# EAGLE design 231_adc (EAGLE 9.6.2)
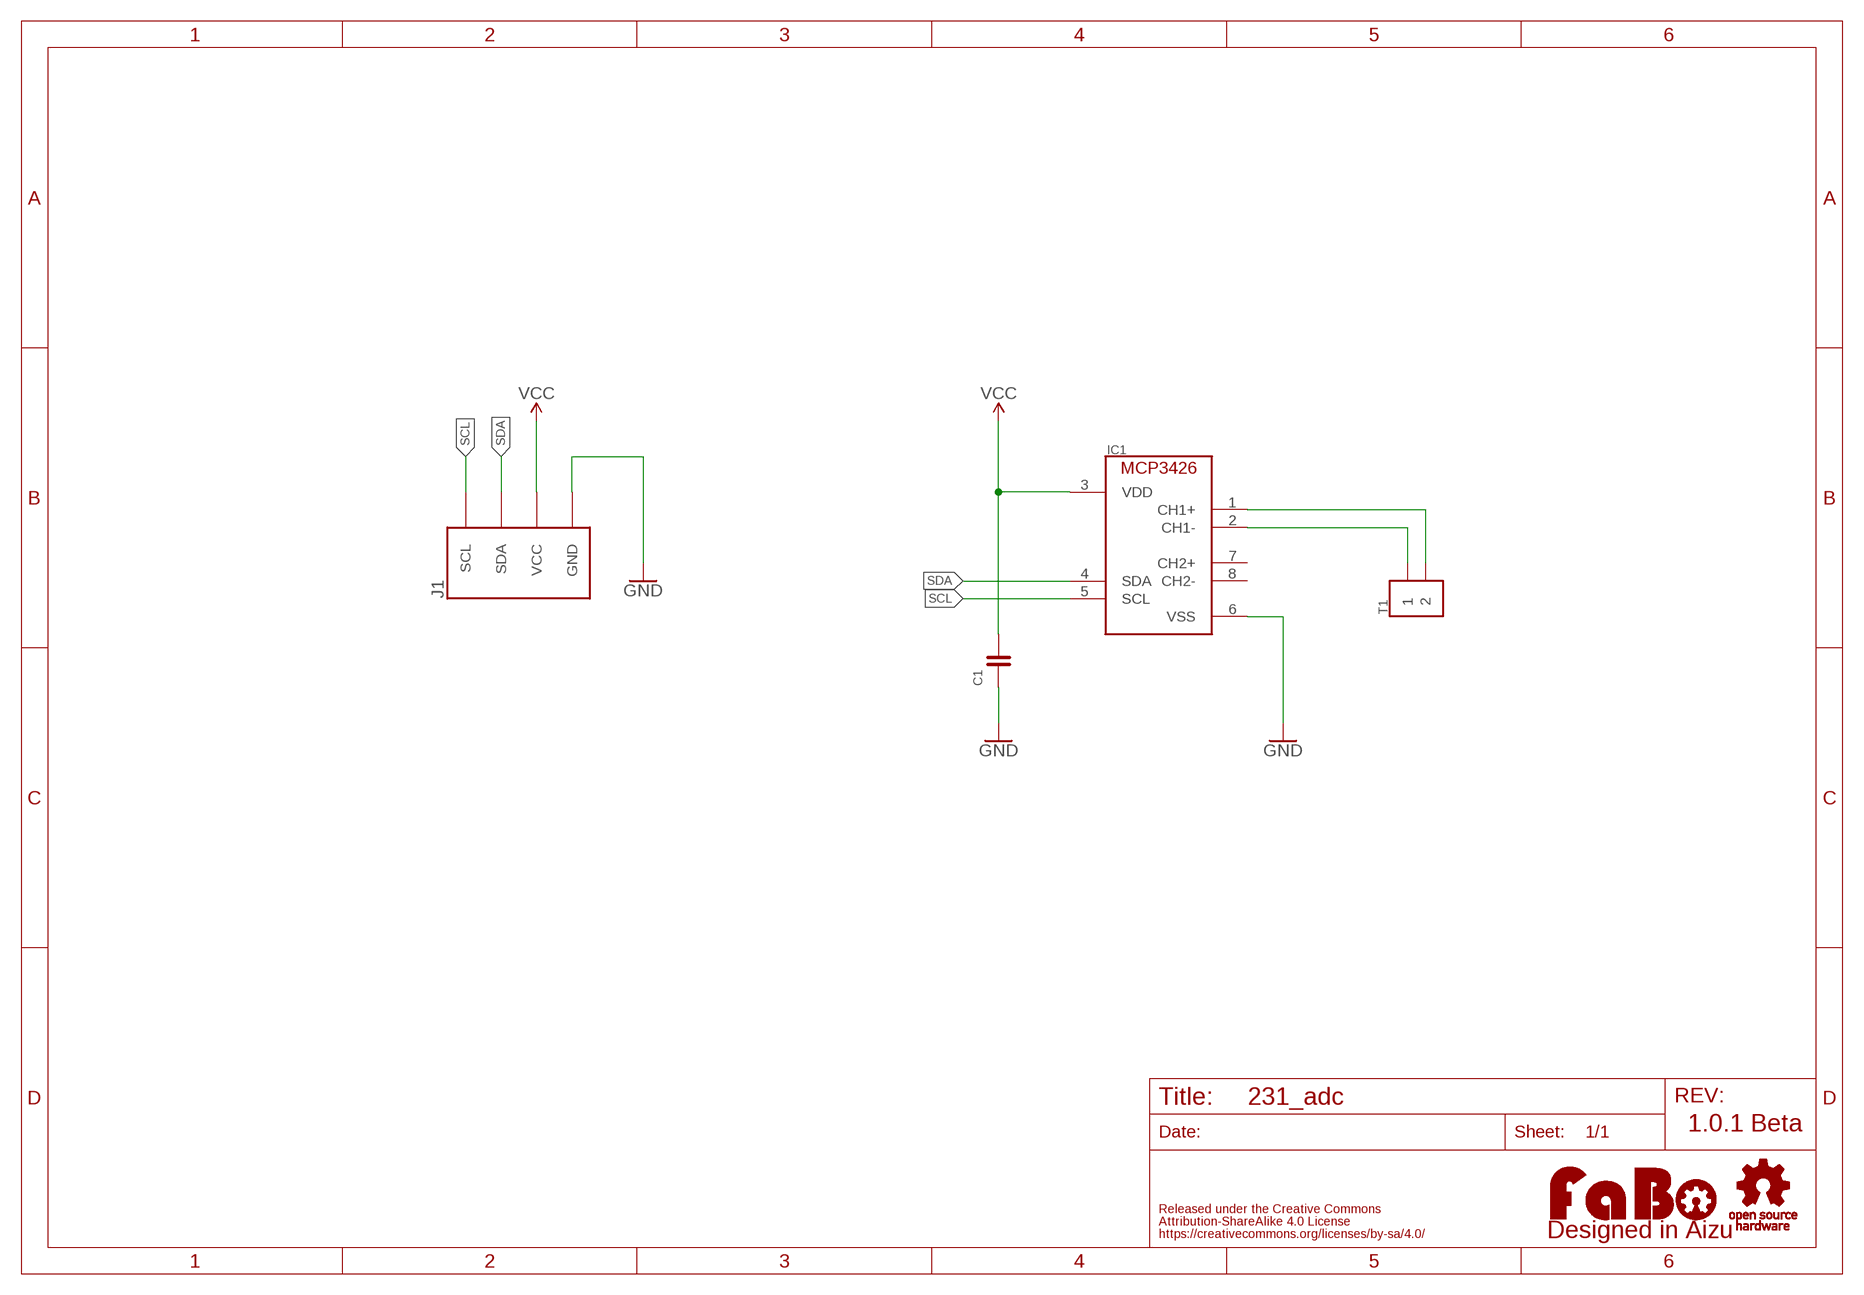
[diagram p0: schematic, sheet 1]

## Parts
C1  CAPACITOR-0603  [EIA0603]
IC1  MCP3426/MS  [MSOP-8]
J1  FABO_BRICK_I2C  [FABO_BRICK_I2C]
LOGO1  LOGO_FABO-M  [LOGO_FABO_M]
T1  ML-1400-S1-2P  [ML-1400-S1-2P]
U$2  LOGO_OSHW-M_BOTTOM  [LOGO_OSHW_M_BOTTOM]

## Nets
CH1M: IC1.2(CH1-) T1.P1-1 T1.P1-2
CH1P: IC1.1(CH1+) T1.P2-1 T1.P2-2
GND: C1.1 IC1.6(VSS) J1.GND
SCL: IC1.5(SCL) J1.SCL
SDA: IC1.4(SDA) J1.SDA
VCC: C1.2 IC1.3(VDD) J1.VCC
Unconnected: IC1.7(CH2+) IC1.8(CH2-)

## Notes on the sheet
- 1.0.1 Beta

## Library data of the parts
C1 = component:CAPACITOR
IC1 = component:MCP3426
J1 = FaBo-Template:FABO_BRICK_I2C: FaBo Brick I2C
LOGO1 = component:LOGO_FABO
T1 = component:ML-1400-S1-2P
U$2 = FaBo-etc:LOGO_OSHW

## Board
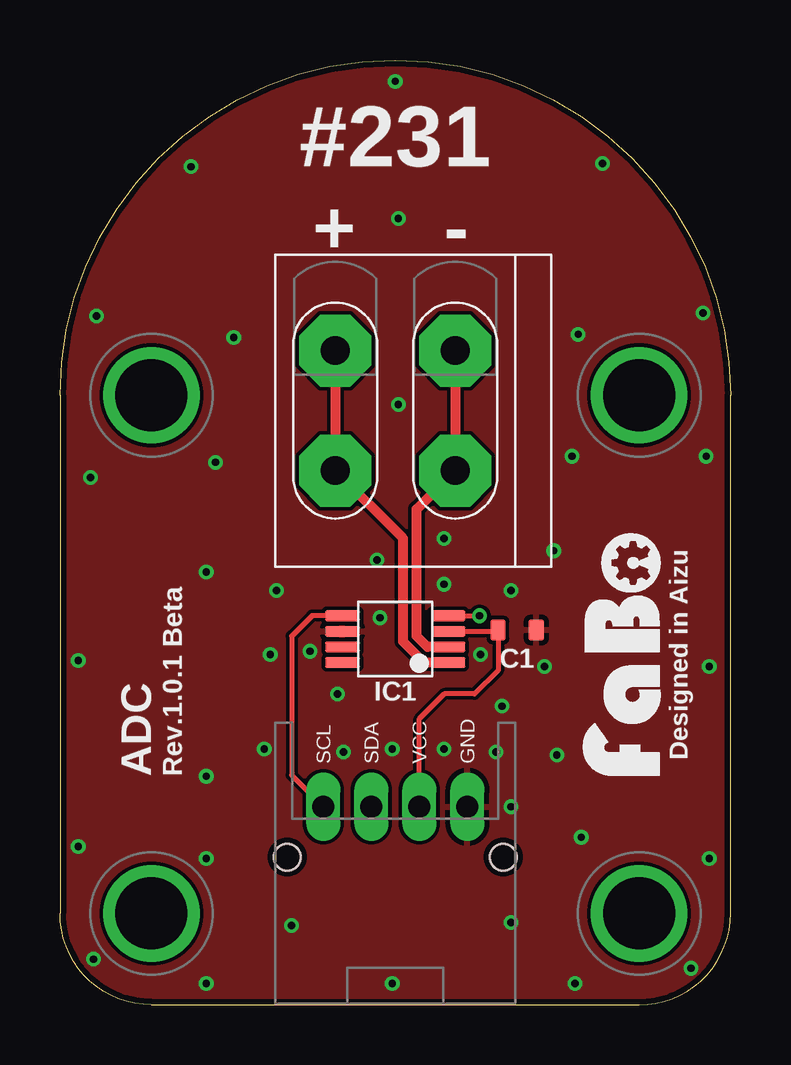
[diagram p1: board, top side]
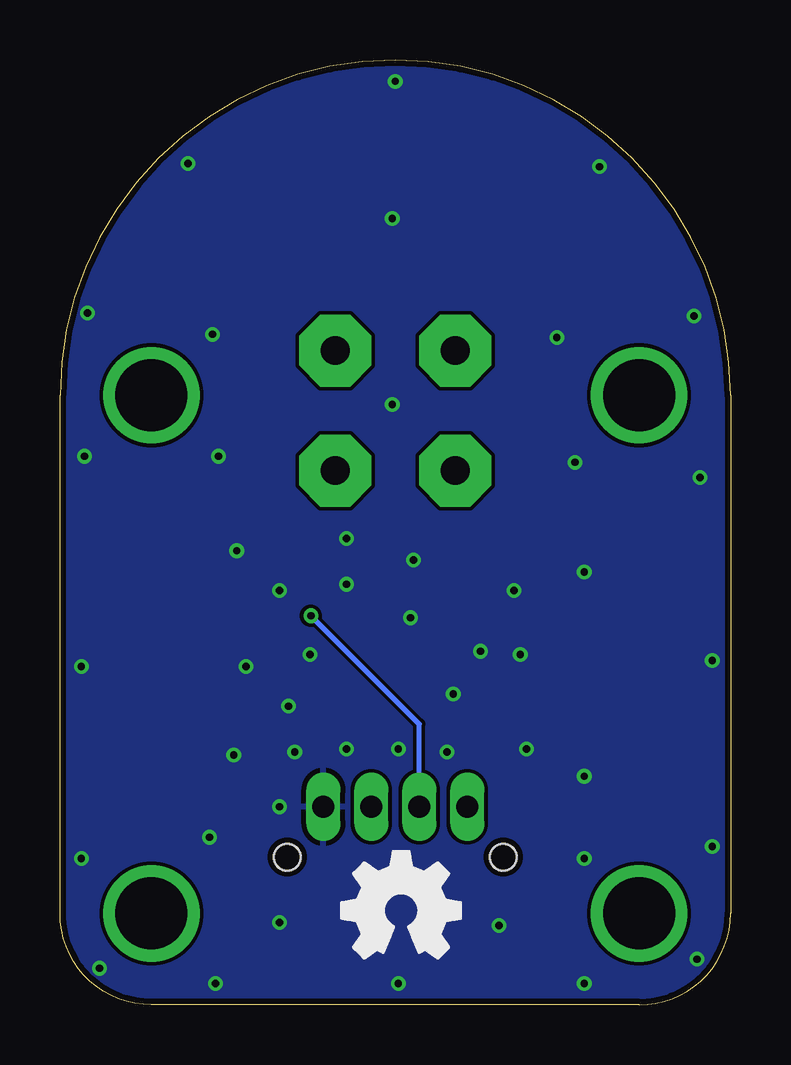
[diagram p2: board, bottom side, seen from below]

Size 27.94 x 39.37 mm. Coordinates in mm from the lower left corner, seen from the top.
Copper layers (1*16): Top 0.035mm / dielectric 1.6mm / Bottom 0.035mm
Design rules "PCBway": minimum track width 6mil, minimum drill 12mil, track to track 6mil, track to pad 6mil, pad to pad 6mil, via to via 6mil, smd to smd 6mil, copper to edge 10mil, drill to drill 10mil, minimum pad ring 10mil, minimum via ring 6mil, stop-mask expansion 2mil, vias tented up to drill 100mil, thermal gap 8mil

### Footprints (pad centres in the part's own frame; a part is rotated, then mirrored left to right if it is on the bottom)
EIA0603 = smd 0.65 x 0.9: 1 -0.8,0; 2 0.8,0
MSOP-8 = smd 0.45 x 1.45: 1 -0.975,-2.2; 2 -0.325,-2.2; 3 0.325,-2.2; 4 0.975,-2.2; 5 0.975,2.2; 6 0.325,2.2; 7 -0.325,2.2; 8 -0.975,2.2
FABO_BRICK_I2C = drill 0.9 pad 1.422 long: GND 3,-10.795; SCL -3,-10.795; SDA -1,-10.795; VCC 1,-10.795 | drill 3 pad 3.81: P$1 -10.16,6.35; P$2 10.16,6.35; P$3 -10.16,-15.24; P$4 10.16,-15.24 | hole 1.1: -4.5,-12.895; 4.5,-12.895
ML-1400-S1-2P = drill 1.2 pad 3 octagon: P1-1 -2.5,2.5; P1-2 -2.5,-2.5; P2-1 2.5,2.5; P2-2 2.5,-2.5

### Placement (x,y rotation side)
C1  19.05,15.62 180 top
IC1  13.97,15.24 90 top
J1  13.97,19.05 0 top
LOGO1  25.4,14.61 90 top
T1  13.97,24.77 180 top
U$2  13.72,3.94 0 top

### Tracks (layer width: path | path; a pad name or v marks a point on that pad's centre or on a via)
CH1M
  Top 0.406: IC1.2 15.31,14.91 14.86,15.37 14.86,20.65 T1.P1-1 T1.P1-2
CH1P
  Top 0.406: IC1.1 15.17,14.27 14.3,15.14 14.3,19.43 T1.P2-1 T1.P2-2
GND  (via drill 0.3)
  other vias: 13.97,38.48 1.52,28.7 26.8,28.83 21.59,27.94 7.24,27.81 5.46,34.92 22.61,35.05 14.1,32.77 6.48,22.61 1.27,21.97 21.34,22.86 26.92,22.86 27.05,6.1 21.46,0.89 21.72,6.99 26.29,1.52 6.1,0.89 6.1,6.1 0.76,6.6 1.4,1.91 0.76,14.35 27.05,14.1 6.1,18.03 6.1,9.53 20.7,10.41 20.57,18.92 18.8,17.27 20.19,14.1 18.8,8.26 18.16,10.54 16,10.67 13.84,10.67 11.81,10.54 8.51,10.67 13.84,0.89 9.65,3.3 18.8,3.43 11.56,12.95 13.34,16.13 13.21,18.54 16,19.43 16,17.53 9.02,17.27 10.41,14.73 8.76,14.61 18.41,12.45 17.53,14.61 14.1,25.02
  pour Top (isolate 0.152, rank 3): 0,0 27.94,0 27.94,39.37 0,39.37
  pour Bottom (isolate 0.152, rank 3): 0,0 27.94,0 27.94,39.37 0,39.37
SCL
  Top 0.203: IC1.5 10.5,16.21 9.65,15.37 9.65,9.57 J1.SCL
SDA  (via drill 0.3)
  Top 0.203: IC1.4 v17.48,16.21
  Bottom 0.203: J1.SDA 12.97,11.7 v17.48,16.21
VCC
  Top 0.203: IC1.3 18.19,15.56 C1.2 18.25,13.93 17.27,12.95 16,12.95 14.97,11.92 J1.VCC

### Text on the board
tPlace: #231 | + | - | Designed in Aizu | ADC | Rev.1.0.1 Beta